# EAGLE design thermocoupleMv2 (EAGLE 6.2)
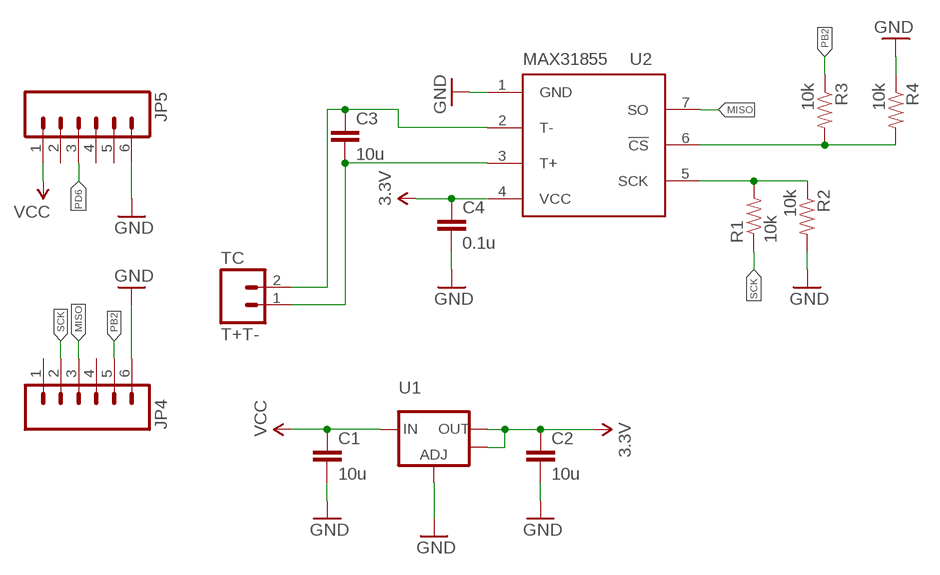
[diagram p0: schematic, sheet 1]

## Parts
C1  10u  CAP0805  [0805]
C2  10u  CAP0805  [0805]
C3  10u  CAP0805  [0805]
C4  0.1u  CAP0805  [0805]
JP4  M06LOCK_LONGPADS  [1X06_LOCK_LONGPADS]
JP5  M06LOCK_LONGPADS  [1X06_LOCK_LONGPADS]
R1  10k  RESISTOR0805-RES  [0805]
R2  10k  RESISTOR0805-RES  [0805]
R3  10k  RESISTOR0805-RES  [0805]
R4  10k  RESISTOR0805-RES  [0805]
TC  T+T-  M02LOCK_LONGPADS  [1X02_LOCK_LONGPADS]
U1  V_REG_LM1117SOT223  [SOT223]
U2  MAX31855  MAX6675  [SO08]

## Nets
3.3V: C2.1 C4.1 U1.2(OUT) U1.4(OUT) U2.4(VCC)
GND: C1.2 C2.2 C4.2 JP4.6 JP5.6 R2.2 R4.1 U1.1(ADJ) U2.1(GND)
MISO: JP4.3 U2.7(SO)
N$1: C3.2 TC.1 U2.3(T+)
N$3: R1.2 R2.1 U2.5(SCK)
N$4: C3.1 TC.2 U2.2(T-)
N$5: R3.2 R4.2 U2.6(!CS)
PB2: JP4.5 R3.1
PD6: JP5.3
SCK: JP4.2 R1.1
VCC: C1.1 JP5.1 U1.3(IN)
Unconnected: JP4.1 JP4.4 JP5.2 JP5.4 JP5.5

## Library data of the parts
C1-C4 = SparkFun-Capacitors:CAP: Capacitor Standard 0603 ceramic capacitor, and 0.1" leaded capacitor.
JP4 JP5 = SparkFun:M06: Header 6 Standard 6-pin 0.1" header. Use with straight break away headers (SKU : PRT-00116), right angle break away headers (PRT-00553), swiss pins (PRT-00743), machine pins (PRT-00117), and female headers (PRT-00115). Molex polarized connector foot print use with SKU : PRT-08094 with associated crimp pins and housings. NOTES ON THE VARIANTS LOCK and LOCK_LONGPADS... This footprint was designed to help hold the alignment of a through-hole component (i.e. 6-pin header) while soldering it into place. You may notice that each hole has been shifted either up or down by 0.005 of an inch from it's more standard position (which is a perfectly straight line). This slight alteration caused the pins (the squares in the middle) to touch the edges of the holes. Because they are alternating, it causes a "brace" to hold the component in place. 0.005 has proven to be the perfect amount of "off-center" position when using our standard breakaway headers. Although looks a little odd when you look at the bare footprint, once you have a header in there, the alteration is very hard to notice. Also, if you push a header all the way into place, it is covered up entirely on the bottom side. This idea of altering the position of holes to aid alignment will be further integrated into the Sparkfun Library for other footprints. It can help hold any component with 3 or more connection pins.
R1-R4 = SparkFun-Passives:RESISTOR: Resistor Basic schematic elements and footprints for 0603, 1206, and PTH resistors.
TC = SparkFun:M02: Header 2 Standard 2-pin 0.1" header. Use with straight break away headers (SKU : PRT-00116), right angle break away headers (PRT-00553), swiss pins (PRT-00743), machine pins (PRT-00117), and female headers (PRT-00115). Molex polarized connector foot print use with SKU : PRT-08233 with associated crimp pins and housings.
U1 = SparkFun-PowerIC:V_REG_LM1117: Voltage Regulator LM1117 Standard adjustable voltage regulator but in SMD form. Spark Fun Electronics SKU : COM-00595
U2 = exoteric-analytics-custom:MAX6675

## Board
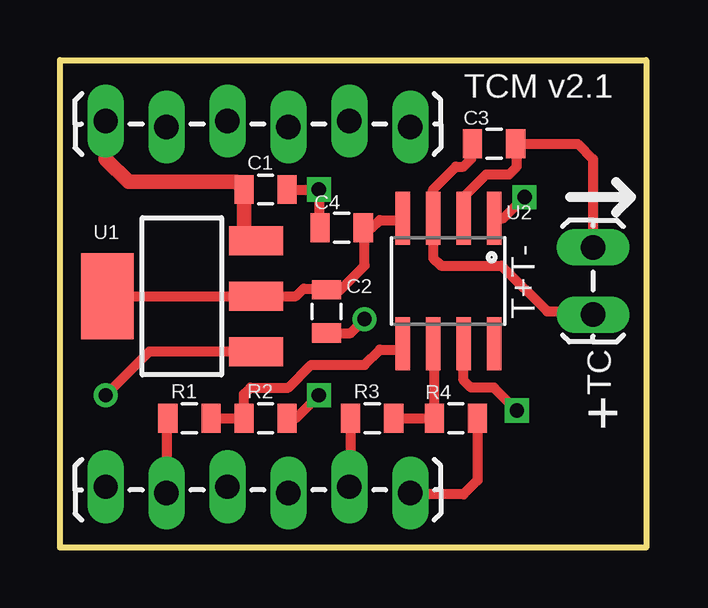
[diagram p1: board, top side]
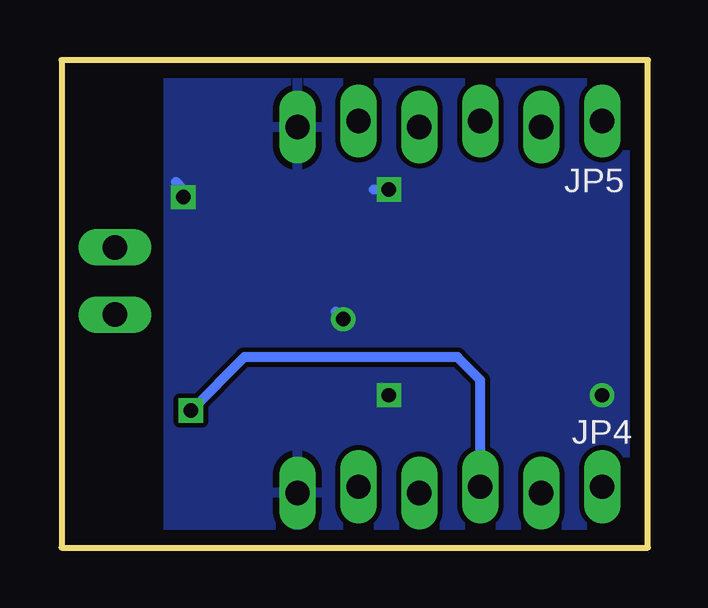
[diagram p2: board, bottom side, seen from below]

Size 24.45 x 20.32 mm. Coordinates in mm from the lower left corner, seen from the top.
Outline: 0,0 0,20.32 24.45,20.32 24.45,0 0,0
Copper layers (1*16): Top 0.035mm / dielectric 1.5mm / Bottom 0.035mm
Design rules "default": minimum track width 10mil, minimum drill 20mil, track to track 8mil, track to pad 8mil, pad to pad 8mil, via to via 8mil, smd to smd 8mil, copper to edge 24mil, drill to drill 8mil, minimum pad ring 10mil, minimum via ring 8mil, stop-mask expansion 4mil, vias tented up to drill 0mil, thermal gap 10mil

### Footprints (pad centres in the part's own frame; a part is rotated, then mirrored left to right if it is on the bottom)
0805 = smd 0.8 x 1.2: 1 -0.9,0; 2 0.9,0
1X06_LOCK_LONGPADS = drill 1.016 long: 1 0,0; 2 2.54,-0.254; 3 5.08,0; 4 7.62,-0.254; 5 10.16,0; 6 12.7,-0.254
1X02_LOCK_LONGPADS = drill 1.016 long: 1 -0.127,0; 2 2.667,0
SOT223 = smd 1.219 x 2.235: 1 -2.311,-3.099; 2 0,-3.099; 3 2.311,-3.099 | smd 3.6 x 2.2: 4 0,3.099
SO08 = smd 0.61 x 2.21: 1 -1.905,-2.616; 2 -0.635,-2.616; 3 0.635,-2.616; 4 1.905,-2.616; 5 1.905,2.616; 6 0.635,2.616; 7 -0.635,2.616; 8 -1.905,2.616

### Placement (x,y rotation side)
C1  8.57,14.92 0 top
C2  11.11,9.84 270 top
C3  18.1,16.83 180 top
C4  11.75,13.34 180 top
JP4  1.91,2.54 0 top
JP5  1.91,17.78 0 top
R1  5.4,5.4 0 top
R2  8.57,5.4 0 top
R3  13.02,5.4 0 top
R4  16.51,5.4 180 top
TC  22.23,9.84 90 top
U1  5.08,10.48 90 top
U2  16.19,11.11 180 top

### Tracks (layer width: path | path; a pad name or v marks a point on that pad's centre or on a via)
3.3V
  Top 0.406: U2.4 14.21,13.65 13.34,13.65 13.02,13.34 C4.1 12.7,13.28 12.7,11.75 11.7,10.74 C2.1 11.06,10.79 10.16,10.79 9.84,10.48 U1.2 U1.4
GND  (via drill 0.6)
  Top 0.406: R4.1 17.41,2.81 16.83,2.22 14.67,2.22 JP4.6 | 8.09,8.26 U1.1 3.72,8.17 v1.91,6.35 | C1.2 v10.79,14.92 10.79,13.39 C4.2 | R2.2 9.84,5.4 v10.79,6.35 | U2.1 18.49,13.73 v19.37,14.61 | C2.2 12.12,8.94 v12.7,9.53
  Bottom 0.406: v10.79,14.92 11.43,14.92 | v10.79,6.35 11.11,6.67 | v19.37,14.61 19.37,14.92 19.68,15.24 | v1.91,6.35 1.59,6.35 | v12.7,9.53 13.02,9.84
  pour Bottom: 0.64,19.68 20,19.68 20,0.64 0.64,0.64
MISO  (via drill 0.6)
  Top 0.406: v19.05,5.71 18.1,6.67 17.14,6.67 16.83,6.99 U2.7
  Bottom 0.406: JP4.3 6.99,6.99 7.94,7.94 16.83,7.94 v19.05,5.71
N$1
  Top 0.406: C3.2 17.14,16.77 17.14,16.19 16.83,15.88 16.51,15.88 15.56,14.92 U2.3 15.56,12.06 15.88,11.75 18.41,11.75 20.32,9.84 22.1,9.84 TC.1
N$3
  Top 0.406: R1.2 R2.1 7.67,6.4 7.94,6.67 9.53,6.67 10.48,7.62 12.7,7.62 13.34,8.26 14.05,8.26 U2.5
N$4
  Top 0.406: U2.2 16.83,14.61 17.78,15.56 18.73,15.56 19.05,15.88 19.05,16.77 C3.1 21.59,16.83 22.23,16.19 TC.2
N$5
  Top 0.406: R3.2 R4.2 15.61,8.44 U2.6
PB2
  Top 0.406: R3.1 12.12,2.59 JP4.5
SCK
  Top 0.406: R1.1 4.45,5.4 JP4.2
VCC
  Top 0.61: JP5.1 1.91,16.19 2.86,15.24 7.36,15.24 C1.1 7.67,13.29 U1.3

### Text on the board
tPlace: TCM v2.1
tNames: +